# EAGLE design AutomaterAward (EAGLE 9.6.2)
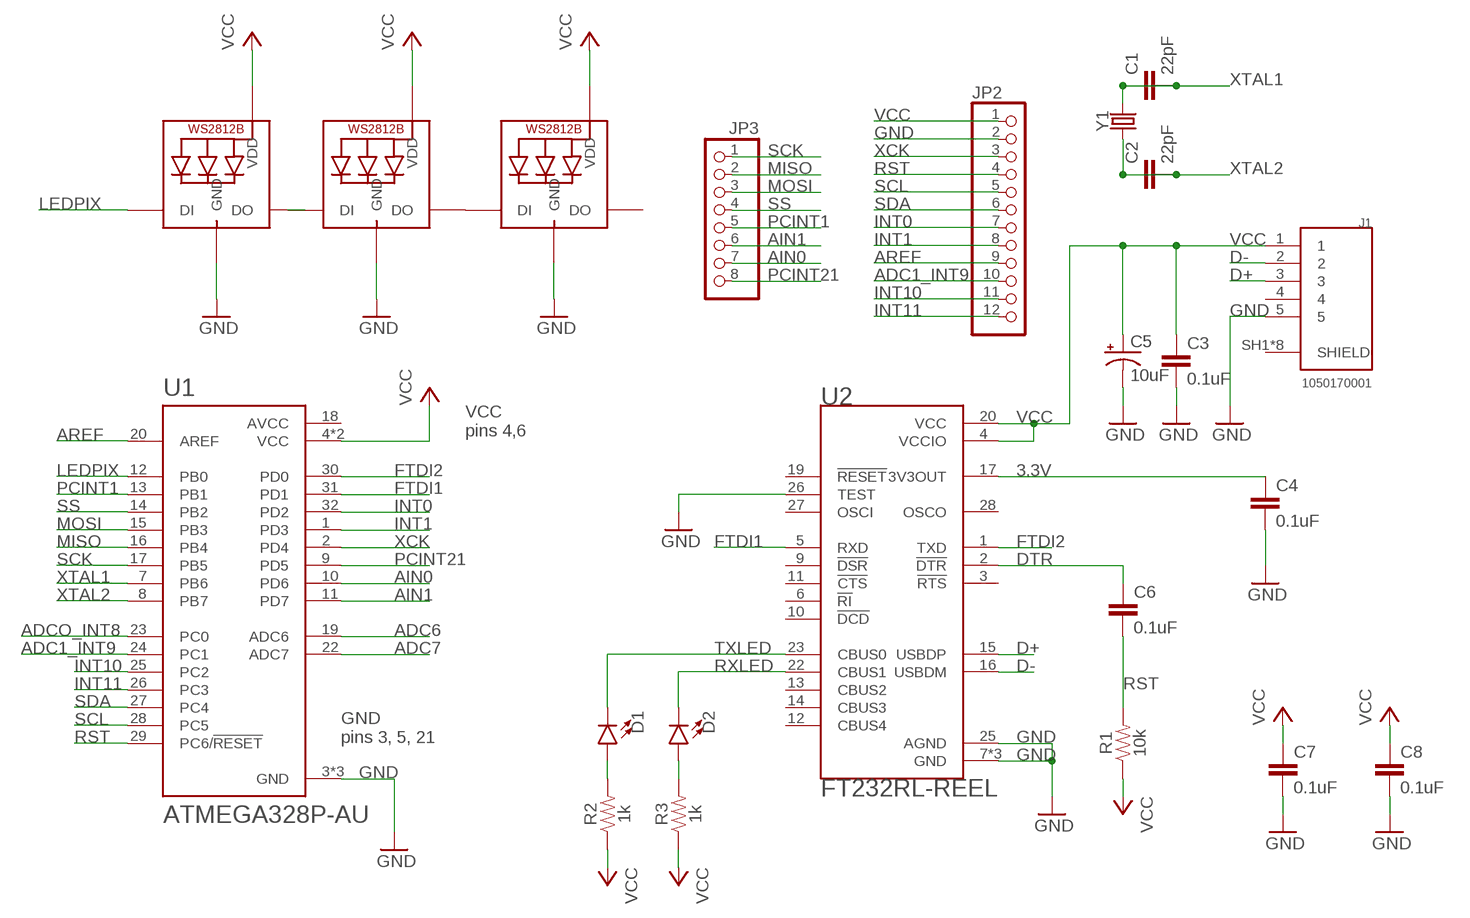
[diagram p0: schematic, sheet 1]

## Parts
C1  22pF  22PF-0603-50V-5%  [0603]
C2  22pF  22PF-0603-50V-5%  [0603]
C3  0.1uF  0.1UF-0603-25V-(+80/-20%)  [0603]
C4  0.1uF  0.1UF-0603-25V-(+80/-20%)  [0603]
C5  10uF  10UF-POLAR-EIA3216-16V-10%(TANT)  [EIA3216]
C6  0.1uF  0.1UF-0603-25V-(+80/-20%)  [0603]
C7  0.1uF  0.1UF-0603-25V-(+80/-20%)  [0603]
C8  0.1uF  0.1UF-0603-25V-(+80/-20%)  [0603]
D1  LED0603  [LED-0603]
D2  LED0603  [LED-0603]
J1  1050170001  [MOLEX_1050170001]
JP2  PINHD-1X12  [1X12]
JP3  PINHD-1X8  [1X08]
LED1  WS2812B3535  [LED3535]
LED2  WS2812B3535  [LED3535]
LED3  WS2812B3535  [LED3535]
R1  10k  10KOHM-0603-1/10W-1%  [0603]
R2  1k  1KOHM-0603-1/10W-1%  [0603]
R3  1k  1KOHM-0603-1/10W-1%  [0603]
U1  ATMEGA328P-AU  [QFP80P900X900X120-32N]
U2  FT232RL-REEL  [SOP65P780X200-28N]
Y1  CRYSTALPTH-HC49US  [HC49US]

## Nets
3.3V: C4.1 U2.17(3V3OUT)
ADC1_INT9: JP2.10 U1.24(PC1)
ADC6: U1.19(ADC6)
ADC7: U1.22(ADC7)
ADCO_INT8: U1.23(PC0)
AIN0: JP3.7 U1.10(PD6)
AIN1: JP3.6 U1.11(PD7)
AREF: JP2.9 U1.20(AREF)
D+: J1.3 U2.15(USBDP)
D-: J1.2 U2.16(USBDM)
DTR: C6.1 U2.2(!DTR)
FTDI1: U1.31(PD1) U2.5(RXD)
FTDI2: U1.30(PD0) U2.1(TXD)
GND: C3.2 C4.2 C5.- C7.2 C8.2 J1.5 JP2.2 LED1.4(GND) LED2.4(GND) LED3.4(GND) U1.3(GND) U1.5(GND) U1.21(GND) U2.7(GND) U2.18(GND) U2.21(GND) U2.25(AGND) U2.26(TEST)
INT0: JP2.7 U1.32(PD2)
INT1: JP2.8 U1.1(PD3)
INT10: JP2.11 U1.25(PC2)
INT11: JP2.12 U1.26(PC3)
LEDPIX: LED1.1(DI) U1.12(PB0)
MISO: JP3.2 U1.16(PB4)
MOSI: JP3.3 U1.15(PB3)
N$1: LED1.3(DO) LED2.1(DI)
N$2: D1.A R2.2
N$3: D2.A R3.2
N$4: LED2.3(DO) LED3.1(DI)
PCINT1: JP3.5 U1.13(PB1)
PCINT21: JP3.8 U1.9(PD5)
RST: C6.2 JP2.4 R1.2 U1.29(PC6/!RESET)
RXLED: D2.C U2.22(CBUS1)
SCK: JP3.1 U1.17(PB5)
SCL: JP2.5 U1.28(PC5)
SDA: JP2.6 U1.27(PC4)
SS: JP3.4 U1.14(PB2)
TXLED: D1.C U2.23(CBUS0)
VCC: C3.1 C5.+ C7.1 C8.1 J1.1 JP2.1 LED1.2(VDD) LED2.2(VDD) LED3.2(VDD) R1.1 R2.1 R3.1 U1.4(VCC) U1.6(VCC) U2.4(VCCIO) U2.20(VCC)
XCK: JP2.3 U1.2(PD4)
XTAL1: C1.1 C1.2 U1.7(PB6) Y1.2
XTAL2: C2.1 C2.2 U1.8(PB7) Y1.1
Unconnected: J1.4 J1.SH1(SHIELD) J1.SH2(SHIELD) J1.SH3(SHIELD) J1.SH4(SHIELD) J1.SH5(SHIELD) J1.SH6(SHIELD) J1.SH7(SHIELD) J1.SH8(SHIELD) LED3.3(DO) U2.3(!RTS) U2.6(!RI) U2.9(!DSR) U2.10(!DCD) U2.11(!CTS) U2.12(CBUS4) U2.13(CBUS2) U2.14(CBUS3) U2.19(!RESET) U2.27(OSCI) U2.28(OSCO)

## Notes on the sheet
- VCC 
  pins 4,6
- GND
  pins 3, 5, 21

## Power pins joined to a net without a drawn wire
AVCC: U1.18(AVCC)

## Library data of the parts
C1 C2 = SparkFun-Capacitors:22PF: 22pF ceramic capacitors A capacitor is a passive two-terminal electrical component used to store electrical energy temporarily in an electric field.; PROD_ID: CAP-07876
C3 C4 C6-C8 = SparkFun-Capacitors:0.1UF: 0.1µF ceramic capacitors A capacitor is a passive two-terminal electrical component used to store electrical energy temporarily in an electric field.; PROD_ID: CAP-00810
C5 = SparkFun-Capacitors:10UF-POLAR: 10.0µF polarized capacitors A capacitor is a passive two-terminal electrical component used to store electrical energy temporarily in an electric field.; PROD_ID: CAP-00811
D1 D2 = SparkFun-LED:LED: LED (Generic) Standard schematic elements and footprints for 5mm, 3mm, 1206, and 0603 sized LEDs. Generic LEDs with no color specified.
J1 = 1050170001:1050170001: Conn.; Data; USB; Recept.; Micro; B Type; Bottom Mount, SMT, with Solder Tabs, Lead-Free; DESCRIPTION: USB - micro B USB 2.0 Receptacle Connector 5 Position Surface Mount, Right Angle; Through Hole; DIGI-KEY_PART_NUMBER: WM1399CT-ND; MF: Molex; MP: 1050170001; PACKAGE: None
JP2 = pinhead:PINHD-1X12: PIN HEADER
JP3 = pinhead:PINHD-1X8: PIN HEADER
LED1-LED3 = adafruit:WS2812B
R1 = SparkFun-Resistors:10KOHM: 10kΩ resistor A resistor is a passive two-terminal electrical component that implements electrical resistance as a circuit element. Resistors act to reduce current flow, and, at the same time, act to lower voltage levels within circuits. - Wikipedia; PROD_ID: RES-00824
R2 R3 = SparkFun-Resistors:1KOHM: 1kΩ resistor A resistor is a passive two-terminal electrical component that implements electrical resistance as a circuit element. Resistors act to reduce current flow, and, at the same time, act to lower voltage levels within circuits. - Wikipedia; PROD_ID: RES-07856
U1 = ATMEGA328P-AU:ATMEGA328P-AU: ATmega Series 20 MHz 32 KB Flash 2 KB SRAM 8-Bit Microcontroller - TQFP-32; AVAILABILITY: Unavailable; DESCRIPTION: AVR AVR® ATmega Microcontroller IC 8-Bit 20MHz 32KB _16K x 16_ FLASH 32-TQFP _7x7_; MF: Microchip; MP: ATMEGA328P-AU; PACKAGE: TQFP-32 Microchip; PRICE: None
U2 = FT232RL-REEL:FT232RL-REEL: USB Full Speed to Serial UART IC, Includes Oscillator and EEPROM - SSOP-28; DESCRIPTION: USB Bridge, USB to UART USB 2.0 UART Interface 28-SSOP; DIGI-KEY_PART_NUMBER: 768-1007-1-ND; MF: FTDI,; MP: FT232RL-REEL; PACKAGE: SSOP-28 FTDI; PURCHASE-URL: https://pricing.snapeda.com/search/part/FT232RL-REEL/?ref=eda
Y1 = SparkFun-Clocks:CRYSTAL: Crystals (Generic) These are passive quartz crystals, which can be used as a clock source for a microcontroller. Crystal's are two-terminal devices. They require external "load" capacitors to generate an oscillating signal.

## Board
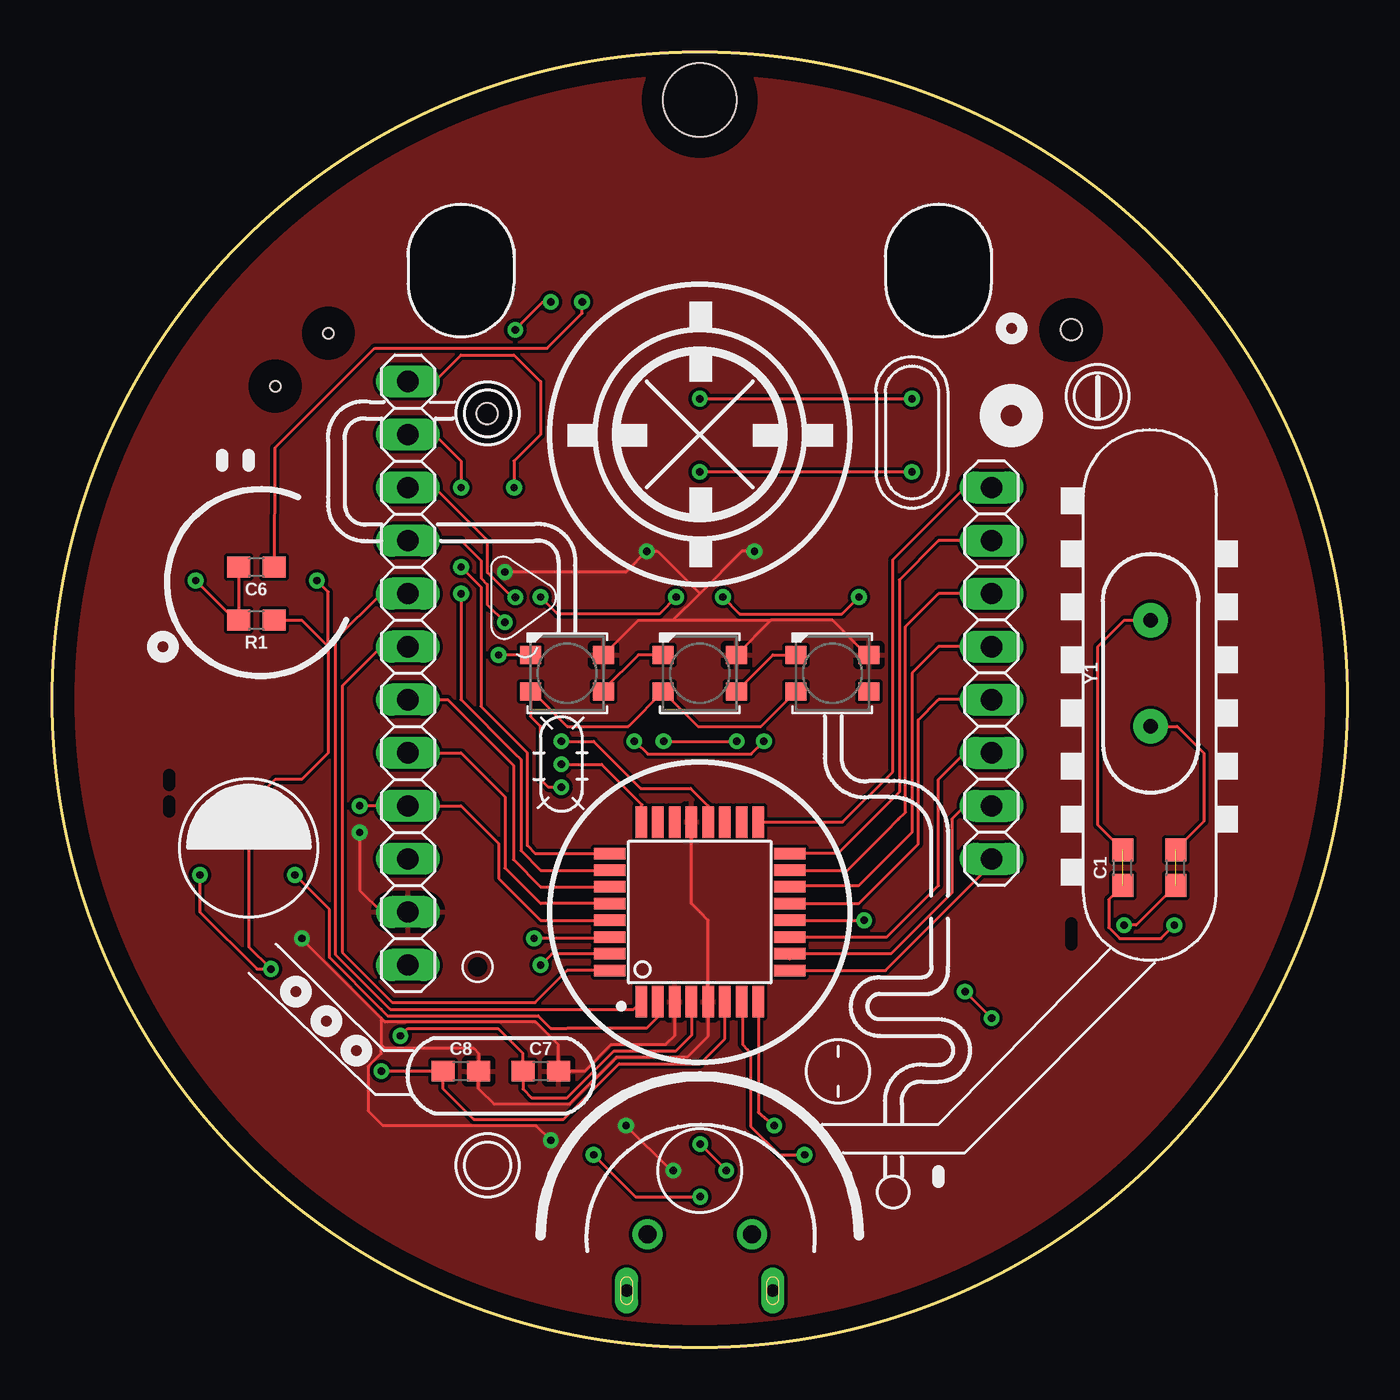
[diagram p1: board, top side]
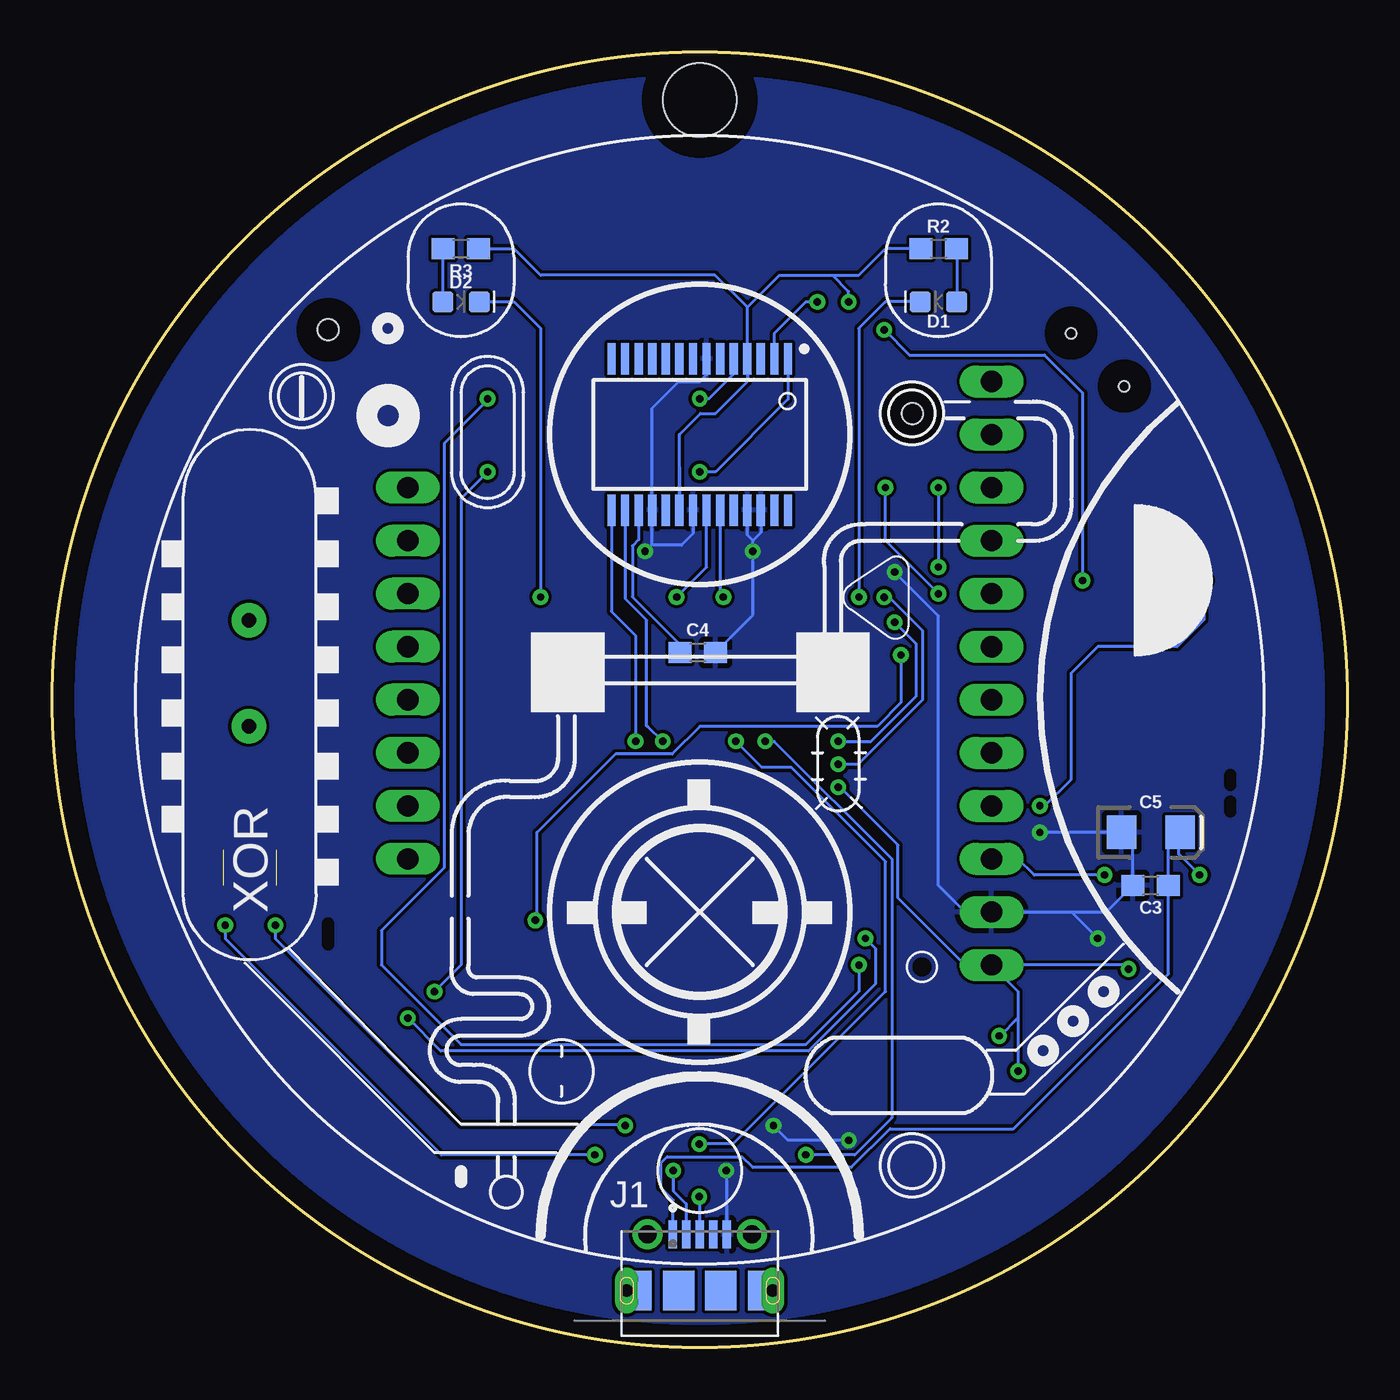
[diagram p2: board, bottom side, seen from below]

Size 62 x 62 mm. Coordinates in mm from the lower left corner, seen from the top.
Outline: circle at 31,31 radius 31
Copper layers (1*16): Top 0.035mm / dielectric 1.5mm / Bottom 0.035mm
Design rules "default": minimum track width 6mil, minimum drill 0.35mm, track to track 6mil, track to pad 6mil, pad to pad 6mil, via to via 6mil, smd to smd 6mil, copper to edge 40mil, drill to drill 6mil, minimum pad ring 10mil, minimum via ring 8mil, stop-mask expansion 4mil, vias tented up to drill 0mil, thermal gap 10mil
Holes 3.5 mm at 31,59.71
Holes 1 mm at 48.78,48.71 20.82,44.71
Holes 0.5 mm at 10.68,46.01 13.22,48.55
tRestrict: area 39.9,48.4 to 45,54.7; area 17,48.4 to 22.1,54.7; area 20.2,18 to 20.6,18.4; 3 lines
bRestrict: area 20.2,18 to 20.6,18.4; 3 lines

### Footprints (pad centres in the part's own frame; a part is rotated, then mirrored left to right if it is on the bottom)
0603 = smd 1.1 x 1: 1 -0.85,0; 2 0.85,0
EIA3216 = smd 1.4 x 1.6: + 1.4,0; - -1.4,0
LED-0603 = smd 1 x 1: A -0.877,0; C 0.877,0
MOLEX_1050170001 = smd 0.4 x 1.35: 1 -1.3,2.35; 2 -0.65,2.35; 3 0,2.35; 4 0.65,2.35; 5 1.3,2.35 | drill 0.85 pad 1.45: SH1 -2.5,2.35; SH2 2.5,2.35 | drill 0.6 pad 0.95 long: SH3 -3.5,-0.35; SH8 3.5,-0.35 | smd 1.2 x 1.9: SH4 -2.9,-0.35; SH7 2.9,-0.35 | smd 1.5 x 1.9: SH5 -1,-0.35; SH6 1,-0.35
1X12 = drill 1.016 long: 1 -13.97,0; 2 -11.43,0; 3 -8.89,0; 4 -6.35,0; 5 -3.81,0; 6 -1.27,0; 7 1.27,0; 8 3.81,0; 9 6.35,0; 10 8.89,0; 11 11.43,0; 12 13.97,0
1X08 = drill 1.016 long: 1 -8.89,0; 2 -6.35,0; 3 -3.81,0; 4 -1.27,0; 5 1.27,0; 6 3.81,0; 7 6.35,0; 8 8.89,0
LED3535 = smd 1 x 0.85: 1 -1.75,0.875; 2 -1.75,-0.875; 3 1.75,-0.875; 4 1.75,0.875
QFP80P900X900X120-32N = smd 1.5 x 0.55: 1 -4.3,2.8; 2 -4.3,2; 3 -4.3,1.2; 4 -4.3,0.4; 5 -4.3,-0.4; 6 -4.3,-1.2; 7 -4.3,-2; 8 -4.3,-2.8; 17 4.3,-2.8; 18 4.3,-2; 19 4.3,-1.2; 20 4.3,-0.4; 21 4.3,0.4; 22 4.3,1.2; 23 4.3,2; 24 4.3,2.8 | smd 0.55 x 1.5: 9 -2.8,-4.3; 10 -2,-4.3; 11 -1.2,-4.3; 12 -0.4,-4.3; 13 0.4,-4.3; 14 1.2,-4.3; 15 2,-4.3; 16 2.8,-4.3; 25 2.8,4.3; 26 2,4.3; 27 1.2,4.3; 28 0.4,4.3; 29 -0.4,4.3; 30 -1.2,4.3; 31 -2,4.3; 32 -2.8,4.3
SOP65P780X200-28N = smd 1.5 x 0.4: 1 -3.625,4.225; 2 -3.625,3.575; 3 -3.625,2.925; 4 -3.625,2.275; 5 -3.625,1.625; 6 -3.625,0.975; 7 -3.625,0.325; 8 -3.625,-0.325; 9 -3.625,-0.975; 10 -3.625,-1.625; 11 -3.625,-2.275; 12 -3.625,-2.925; 13 -3.625,-3.575; 14 -3.625,-4.225; 15 3.625,-4.225; 16 3.625,-3.575; 17 3.625,-2.925; 18 3.625,-2.275; 19 3.625,-1.625; 20 3.625,-0.975; 21 3.625,-0.325; 22 3.625,0.325; 23 3.625,0.975; 24 3.625,1.625; 25 3.625,2.275; 26 3.625,2.925; 27 3.625,3.575; 28 3.625,4.225
HC49US = drill 0.7 pad 1.651: 1 -2.54,0; 2 2.54,0

### Placement (x,y rotation side)
C1  51.25,22.96 90 top
C2  53.79,22.96 90 top
C3  9.41,22.11 180 bottom
C4  31.1,33.27 0 bottom
C5  9.41,24.65 0 bottom
C6  9.77,37.35 180 top
C7  23.38,13.22 0 top
C8  19.57,13.22 0 top
D1  19.57,50.05 180 bottom
D2  42.43,50.05 0 bottom
J1  31,3.06 0 bottom
JP2  17.03,32.27 90 top
JP3  44.97,32.27 270 top
LED1  24.65,32.27 0 top
LED2  31,32.27 0 top
LED3  37.35,32.27 0 top
R1  9.77,34.81 180 top
R2  19.57,52.59 0 bottom
R3  42.43,52.59 180 bottom
U1  31,20.84 90 top
U2  31,43.7 270 bottom
Y1  52.59,32.27 90 top

### Tracks (layer width: path | path; a pad name or v marks a point on that pad's centre or on a via)
3.3V
  Bottom 0.152: C4.1 31.95,33.65 33.54,35.24 34.23,35.93 34.23,38.36 33.92,38.66 U2.17
ADC1_INT9  (via drill 0.35)
  Top 0.152: 16.97,41.1 JP2.10 18.3,41.16 20.84,38.62 20.84,37.08 22.01,35.91 v22.17,35.91 | U1.24 28.2,25.92 28.24,25.96 26.3,27.91 v24.37,27.91
  Bottom 0.152: v24.37,27.91 23.38,27.91 23.38,27.94 20.32,31 20.32,34.29 21.94,35.91 v22.17,35.91
AIN0
  Top 0.152: 35.3,18.59 U1.10 40.16,18.84 43.06,21.75 43.06,25.29 43.7,25.92 JP3.7
AIN1
  Top 0.152: JP3.6 43.7,28.46 42.43,27.19 42.43,22.11 39.96,19.64 U1.11
AREF  (via drill 0.35)
  Top 0.152: JP2.9 19.57,38.62 20.54,37.66 20.54,36.82 20.83,36.52 20.83,36.08 20.83,35.55 v21.67,34.71 20.84,35.54 | U1.20 31.4,25.92 30.57,26.76 28.18,26.76 25.92,29.01 v24.37,29.01
  Bottom 0.152: v24.37,29.01 22.79,29.01 20.63,31.18 20.63,33.67 v21.67,34.71
D+  (via drill 0.35)
  Top 0.152: v25.92,9.21 27.92,7.21 v31.02,7.21 | v27.87,29.01 27.91,29.01 28.52,28.4 33.46,28.4 v34.07,29.01
  Bottom 0.152: 31,6.87 J1.3 31,5.6 31.02,5.62 v31.02,7.21 | U2.15 35.23,35.23 34.07,34.07 v34.07,29.01 | v25.92,9.21 23.58,9.21 21.8,10.99 21.8,23.38 27.44,29.01 v27.87,29.01
D-  (via drill 0.35)
  Top 0.152: v31.02,9.73 32.27,8.48 v32.27,8.46 | v29.27,29.01 v32.77,29.01
  Bottom 0.152: J1.2 31.65,6.87 32.27,7.49 v32.27,8.46 | v31.02,9.73 29.41,9.73 22.11,17.03 22.11,23.25 26.62,27.76 28.02,27.76 v29.27,29.01 | U2.16 34.58,35.84 33.54,34.81 33.54,29.73 33.49,29.73 v32.77,29.01
DTR  (via drill 0.35)
  Top 0.152: C6.1 10.66,42.43 10.66,43.05 15.44,47.83 23.7,47.83 25.37,49.5 v25.37,50.05
  Bottom 0.152: U2.2 27.43,48.55 25.92,50.05 v25.37,50.05
FTDI1  (via drill 0.35)
  Top 0.152: U1.31 23.92,18.84 v23.38,18.3 | v41.16,45.41 41.14,45.41 v31,45.41
  Bottom 0.152: U2.5 29.38,46.59 30.56,45.41 v31,45.41 | v41.16,45.41 41.37,45.13 43.22,43.28 43.22,42.91 43.22,22.97 46.24,19.95 46.24,18.3 42.43,14.49 25.92,14.49 23.38,17.03 v23.38,18.3
FTDI2  (via drill 0.35)
  Top 0.152: U1.30 26.63,19.57 v23.07,19.57 | v31,41.91 31.03,41.91 v41.16,41.91 | v44.97,15.76 v43.7,17.03
  Bottom 0.152: 26.78,46.66 U2.1 26.78,45.38 30.25,41.91 v31,41.91 | v41.16,41.91 42.43,40.64 42.43,18.3 v43.7,17.03 | v23.07,19.57 22.59,19.09 22.59,17.39 25.79,14.19 43.39,14.19 v44.97,15.76
GND  (via drill 0.35)
  Top 0.152: v29.73,8.46 29.62,8.46 v27.47,10.61 | LED3.4 39.02,33.15 37.35,34.81 34.42,34.81 | 34.42,34.81 LED2.4 | LED1.4 28.07,34.81 29.73,34.81 | 29.73,34.81 34.42,34.81 | U1.3 29.8,14.92 29.37,14.49 26.76,14.49 25.49,13.22 C7.2 24.23,14.48 23.14,15.57 15.93,15.57 15.75,15.75 | U1.21 30.6,21.24 31,20.84 31.4,20.44 U1.5 31.4,14.89 30.39,13.88 27.01,13.88 24.78,11.65 21.15,11.65 20.42,12.37 C8.2 20.42,14.07 20.19,14.3 15.95,14.3 15.75,14.5 | 29.73,34.81 31,36.08 | v33.62,38.11 33.03,38.11 31,36.08 | 31,36.08 28.97,38.11 v28.46,38.11 27.46,37.11 v21.67,37.11 | v23.87,9.91 23.17,10.61 15.83,10.61 15.15,11.29 15.15,13.47 15.75,14.07 15.75,14.5 | 15.75,15.75 15.75,14.5 | v11.95,19.57 11.95,19.55 15.75,15.75 | v14.72,24.65 14.72,21.88 15.76,20.84 JP2.2
  Bottom 0.152: J1.5 29.7,8.11 v29.73,8.46 | 13.22,20.84 JP2.2 18.3,20.84 19.57,22.11 19.57,35.01 v21.67,37.11 | 13.22,20.84 11.53,20.84 C3.2 10.26,24.1 C5.- v14.72,24.65 | 28.46,38.62 28.73,38.88 U2.25 | v33.62,38.11 33.33,38.41 | 33.33,38.41 33.28,38.45 U2.18 33.28,44.97 32.01,46.24 31,46.24 30.68,46.56 U2.7 | 28.46,38.62 v28.46,38.11 28.46,35.06 C4.2 | U2.26 28.07,39.01 28.46,38.62 | v23.87,9.91 26.77,9.91 v27.47,10.61 | v11.95,19.57 13.22,20.84 | U2.21 31.32,38.95 31.87,38.41 33.33,38.41
  pour Bottom: 17.03,62.75 47.51,62.75 50.05,60.21 62.75,47.51 62.75,19.57 62.75,17.03 44.97,-0.75 19.57,-0.75 15.76,-0.75 -2.02,17.03 -2.02,20.84 -2.02,44.97 15.76,62.75
  pour Top: 14.49,64.02 46.24,64.02 64.02,46.24 64.02,18.3 46.24,0.52 13.22,0.52 -0.75,14.49 -0.75,48.78
INT0
  Top 0.152: U1.32 24.65,18.04 23.12,16.51 16.28,16.51 13.88,18.91 13.88,25.67 13.88,25.92 13.88,31.66 15.76,33.54 JP2.7
INT1
  Top 0.152: JP2.8 15.76,36.08 13.58,33.9 13.58,18.78 16.18,16.18 27.84,16.18 U1.1
INT10  (via drill 0.35)
  Top 0.152: U1.25 23.12,23.64 22.75,24.02 22.75,28.46 20.52,30.68 20.52,36.4 v19.57,37.35 | JP2.11 18.3,43.7 19.57,42.43 v19.57,41.16
  Bottom 0.152: v19.57,41.16 v19.57,37.35
INT11  (via drill 0.35)
  Top 0.152: U1.26 23.38,22.84 22.44,23.78 22.44,28.13 22.11,28.46 19.57,31 v19.57,36.08 | v22.11,41.16 22.11,42.43 23.38,43.7 23.38,46.24 22.11,47.51 19.57,47.51 18.3,46.24 JP2.12
  Bottom 0.152: v22.11,41.16 22.11,38.62 v19.57,36.08
LEDPIX  (via drill 0.35)
  Top 0.152: LED1.1 v21.37,33.15 | U1.12 v38.87,20.44
  Bottom 0.152: v38.87,20.44 38.79,20.52 38.79,24.65 35.04,28.4 32.33,28.4 31,29.73 22.51,29.73 21.37,30.87 v21.37,33.15
MISO
  Top 0.152: U1.16 37.61,23.64 40.55,26.58 40.55,36.74 42.43,38.62 JP3.2
MOSI
  Top 0.152: U1.15 38.08,22.84 39.89,24.65 40.5,25.26 | 40.53,25.29 40.5,25.26 | JP3.3 42.43,36.08 40.86,34.51 40.86,25.62 40.5,25.26
N$1
  Top 0.152: LED2.1 28.07,33.15 26.4,31.48 LED1.3
N$2
  Bottom 0.152: R2.2 18.69,52.56 D1.A
N$3
  Bottom 0.152: R3.2 43.31,52.56 D2.A
N$4
  Top 0.152: LED2.3 34.5,33.15 LED3.1
PCINT1
  Top 0.152: U1.13 38.62,21.24 41.47,24.09 41.47,30.04 42.43,31 JP3.5
PCINT21
  Top 0.152: U1.9 39.89,18.04 44.97,23.12 JP3.8
RST  (via drill 0.35)
  Top 0.152: U1.29 23.38,20.44 21.37,22.45 21.37,24.12 19.57,25.92 JP2.4 v14.72,25.92 | C6.2 R1.2 8.77,34.81 v6.87,36.71
  Bottom 0.152: v6.87,36.71 6.87,34.81 8.14,33.54 11.95,33.54 13.22,32.27 13.22,27.19 14.49,25.92 v14.72,25.92
RXLED  (via drill 0.35)
  Top 0.152: v32.11,35.92 32.91,35.12 37.82,35.12 v38.62,35.92
  Bottom 0.152: U2.22 30.68,37.35 v32.11,35.92 | D2.C 39.89,50.05 38.62,48.78 v38.62,35.92
SCK
  Top 0.152: JP3.1 43.7,41.16 40.25,37.71 40.25,27.55 37.84,25.14 U1.17
SCL
  Top 0.152: U1.28 23.38,21.24 21.68,22.95 21.68,26.36 20.84,27.19 19.57,28.46 JP2.5
SDA
  Top 0.152: 18.3,31 JP2.6 18.94,31 22.08,27.86 22.08,23.35 23.38,22.04 U1.27
SS
  Top 0.152: U1.14 35.37,22.11 38.62,22.11 41.16,24.65 41.16,32.27 42.43,33.54 JP3.4
TXLED  (via drill 0.35)
  Top 0.152: v23.38,35.92 v23.39,35.92 24.19,35.12 29.07,35.12 v29.87,35.92
  Bottom 0.152: D1.C 22.11,50.05 23.38,48.78 v23.38,35.92 | v29.87,35.92 30.03,36.07 U2.23
VCC  (via drill 0.35)
  Top 0.152: 32.2,16.49 U1.6 32.2,14.78 31,13.58 27.14,13.58 24.48,10.92 20.18,10.92 18.72,12.37 C8.1 v15.76,13.22 | LED3.2 33.94,29.73 30.92,29.73 LED2.2 27.59,29.73 24.65,29.73 22.98,31.4 LED1.2 22.9,30.21 23.38,29.73 23.38,27.19 23.76,26.81 v24.37,26.81 | U1.4 30.6,14.93 29.86,14.19 26.89,14.19 24.65,11.95 22.95,11.95 22.53,12.37 C7.1 22.53,14.07 21.34,15.27 17.02,15.27 v16.67,14.91 | v7.07,22.61 7.07,20.84 9.8,18.11 v10.47,18.11 9.41,19.17 9.41,25.92 10.68,27.19 11.95,27.19 13.22,28.46 13.22,33.54 | R1.1 11.95,34.81 13.22,33.54 | 13.22,33.54 13.27,33.59 13.22,33.65 13.22,36.16 v12.67,36.71 | v22.17,48.71 23.51,50.05 v23.87,50.05
  Bottom 0.152: J1.1 32.27,5.44 32.27,7.06 32.88,7.67 32.88,8.8 32.56,9.12 28.98,9.12 28.46,8.6 23.76,8.6 21.89,10.46 15.98,10.46 8.56,17.88 C3.1 8.56,24.1 8.08,24.59 | R3.1 39.89,52.59 38.62,51.32 30.26,51.32 28.73,49.79 | R2.1 22.11,52.59 23.38,51.32 24.65,51.32 | JP2.1 18.3,18.3 21.5,21.5 21.5,24.04 24.27,26.81 v24.37,26.81 | 28.73,49.79 U2.4 28.73,46.24 30.26,44.71 30.96,44.71 31.98,43.7 U2.20 31.98,42.13 | 28.73,49.79 27.19,51.32 24.65,51.32 | 8.08,24.59 C5.+ | v7.07,22.61 8.08,23.62 8.08,24.59 | JP2.1 15.76,17.03 15.76,15.76 | 15.76,15.76 v15.76,13.22 | v10.47,18.11 10.66,18.3 JP2.1 | v16.67,14.91 16.61,14.91 15.76,15.76 | v12.67,36.71 12.67,45.69 14.49,47.51 20.97,47.51 v22.17,48.71 | v23.87,50.05 23.87,50.54 24.65,51.32
XCK  (via drill 0.35)
  Top 0.152: U1.2 29,15.82 28.46,15.28 24.65,15.28 23.86,15.28 23.27,15.88 16.05,15.88 15.75,16.18 13.27,18.65 13.27,20.96 v11.62,22.61
  Bottom 0.152: JP2.3 15.76,23.38 14.99,22.61 v11.62,22.61
XTAL1  (via drill 0.35)  (1 unrouted)
  Top 0.152: U1.7 33.05,16.49 33.05,14.49 33.3,14.25 33.44,14.1 33.44,10.58 34.81,9.21 v36.02,9.21 | Y1.2 51.32,34.81 50.05,33.54 50.05,25.01 C1.2 | v53.72,20.21 53.08,19.57 51.1,19.57 50.58,20.1 50.58,21.44 C1.1
  Bottom 0.152: v36.02,9.21 43.36,9.21 53.72,19.57 v53.72,20.21
XTAL2  (via drill 0.35)  (1 unrouted)
  Top 0.152: U1.8 33.8,11.25 v34.57,10.61 | Y1.1 53.86,29.73 55.13,28.46 55.13,25.17 53.79,23.83 C2.2 | C2.1 51.89,20.21 v51.32,20.21
  Bottom 0.152: v34.57,10.61 34.64,10.68 42.43,10.68 51.32,19.57 v51.32,20.21

### Text on the board
bPlace: XOR
tStop: 92 | 120 | AUTOMATER / AWARD | 102 | 97 | 103 | 124 | 96 | 68 | Awake / Labs | 103 | 51 | 114 | 116 | 125 | 125 | 119 | 122
bStop: MMXXI | C | A | R | U | E | T | A | O | T | M | E | 0x13 | A | O | T | R | E | B | D | E